# Altium schematic sheet MotorDriver.SchDoc
size A4
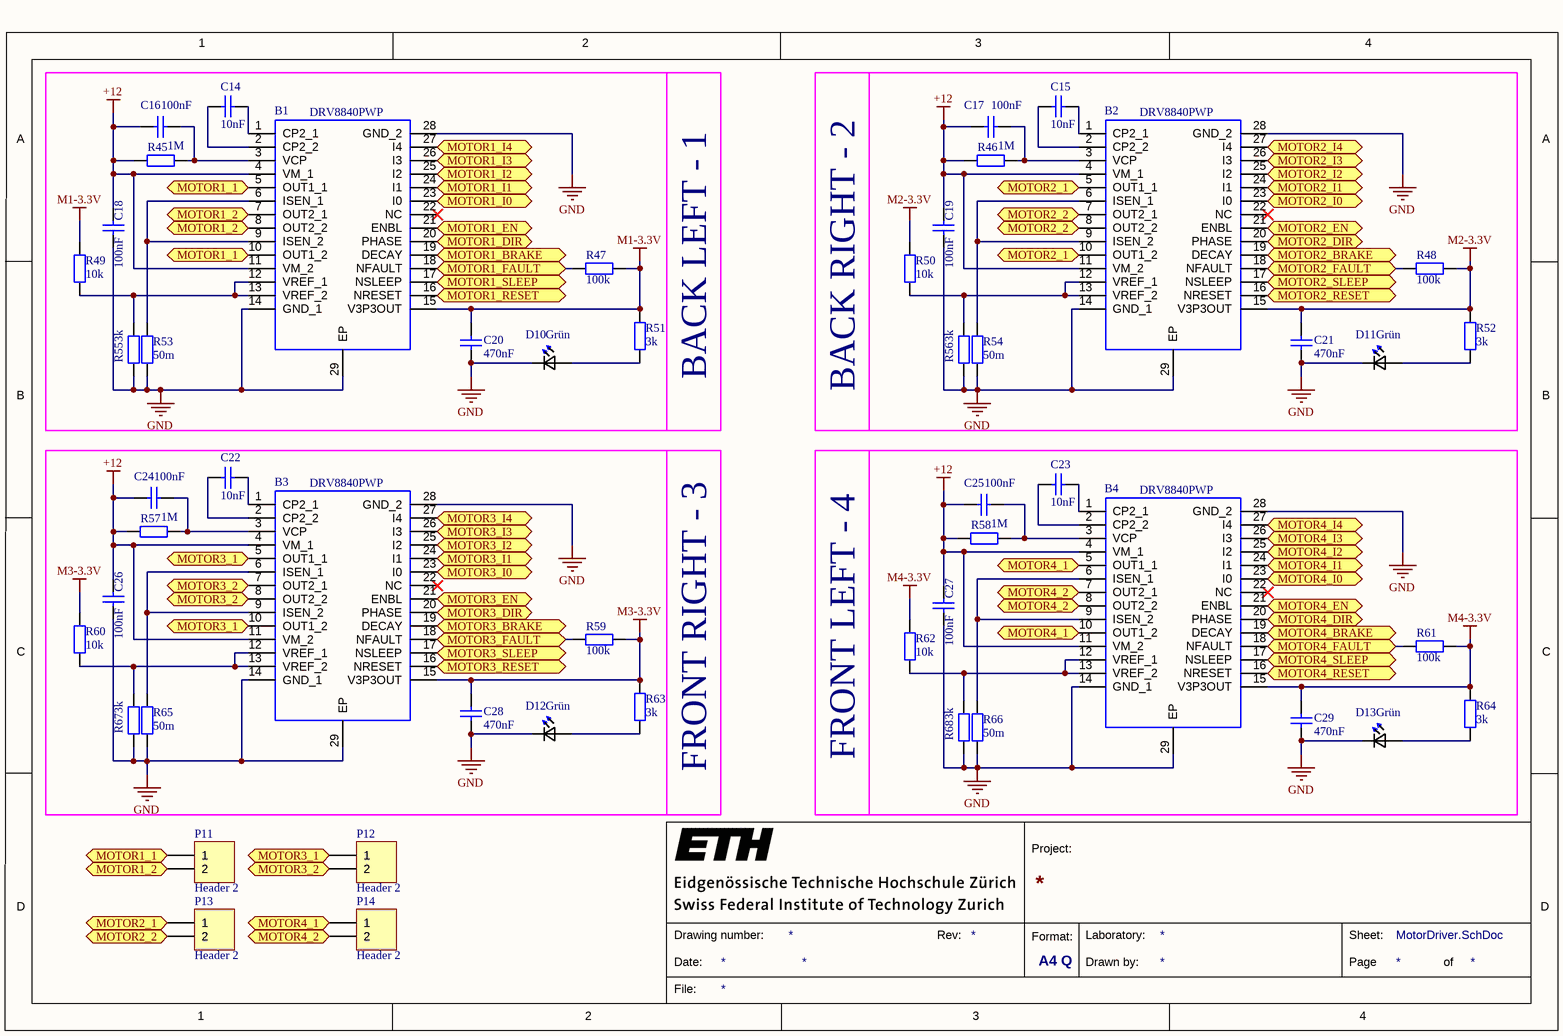
[diagram p0: MotorDriver.SchDoc]

## Parts
B1  DRV8840PWP  [SOP65P640X120-29N]
B2  DRV8840PWP  [SOP65P640X120-29N]
B3  DRV8840PWP  [SOP65P640X120-29N]
B4  DRV8840PWP  [SOP65P640X120-29N]
C14  10nF  [CAP_0603i_1608m -N]
C15  10nF  [CAP_0603i_1608m -N]
C16  100nF  [CAP_0603i_1608m -N]
C17  100nF  [CAP_0603i_1608m -N]
C18  100nF  [CAP_0603i_1608m -N]
C19  100nF  [CAP_0603i_1608m -N]
C20  470nF  [CAP_0603i_1608m -N]
C21  470nF  [CAP_0603i_1608m -N]
C22  10nF  [CAP_0603i_1608m -N]
C23  10nF  [CAP_0603i_1608m -N]
C24  100nF  [CAP_0603i_1608m -N]
C25  100nF  [CAP_0603i_1608m -N]
C26  100nF  [CAP_0603i_1608m -N]
C27  100nF  [CAP_0603i_1608m -N]
C28  470nF  [CAP_0603i_1608m -N]
C29  470nF  [CAP_0603i_1608m -N]
D10  Grün  [*0603]
D11  Grün  [*0603]
D12  Grün  [*0603]
D13  Grün  [*0603]
P11  Header 2  [3.5MM Phoenix Contact 1984617]
P12  Header 2  [3.5MM Phoenix Contact 1984617]
P13  Header 2  [3.5MM Phoenix Contact 1984617]
P14  Header 2  [3.5MM Phoenix Contact 1984617]
R45  1M  [RES_0805i_2012m -N]
R46  1M  [RES_0805i_2012m -N]
R47  100k  [RES_0805i_2012m -N]
R48  100k  [RES_0805i_2012m -N]
R49  10k  [RES_0805i_2012m -N]
R50  10k  [RES_0805i_2012m -N]
R51  3k  [RES_0805i_2012m -N]
R52  3k  [RES_0805i_2012m -N]
R53  50m  [RES_1206i_C3216m -N]
R54  50m  [RES_1206i_C3216m -N]
R55  3k  [RES_0805i_2012m -N]
R56  3k  [RES_0805i_2012m -N]
R57  1M  [RES_0805i_2012m -N]
R58  1M  [RES_0805i_2012m -N]
R59  100k  [RES_0805i_2012m -N]
R60  10k  [RES_0805i_2012m -N]
R61  100k  [RES_0805i_2012m -N]
R62  10k  [RES_0805i_2012m -N]
R63  3k  [RES_0805i_2012m -N]
R64  3k  [RES_0805i_2012m -N]
R65  50m  [RES_1206i_C3216m -N]
R66  50m  [RES_1206i_C3216m -N]
R67  3k  [RES_0805i_2012m -N]
R68  3k  [RES_0805i_2012m -N]

## Ports
MOTOR1_1 (bidir), MOTOR1_2 (bidir), MOTOR1_BRAKE (bidir), MOTOR1_DIR (bidir), MOTOR1_EN (bidir), MOTOR1_FAULT (bidir), MOTOR1_I0 (bidir), MOTOR1_I1 (bidir), MOTOR1_I2 (bidir), MOTOR1_I3 (bidir), MOTOR1_I4 (bidir), MOTOR1_RESET (bidir), MOTOR1_SLEEP (bidir), MOTOR2_1 (bidir), MOTOR2_2 (bidir), MOTOR2_BRAKE (bidir), MOTOR2_DIR (bidir), MOTOR2_EN (bidir), MOTOR2_FAULT (bidir), MOTOR2_I0 (bidir), MOTOR2_I1 (bidir), MOTOR2_I2 (bidir), MOTOR2_I3 (bidir), MOTOR2_I4 (bidir), MOTOR2_RESET (bidir), MOTOR2_SLEEP (bidir), MOTOR3_1 (bidir), MOTOR3_2 (bidir), MOTOR3_BRAKE (bidir), MOTOR3_DIR (bidir), MOTOR3_EN (bidir), MOTOR3_FAULT (bidir), MOTOR3_I0 (bidir), MOTOR3_I1 (bidir), MOTOR3_I2 (bidir), MOTOR3_I3 (bidir), MOTOR3_I4 (bidir), MOTOR3_RESET (bidir), MOTOR3_SLEEP (bidir), MOTOR4_1 (bidir), MOTOR4_2 (bidir), MOTOR4_BRAKE (bidir), MOTOR4_DIR (bidir), MOTOR4_EN (bidir), MOTOR4_FAULT (bidir), MOTOR4_I0 (bidir), MOTOR4_I1 (bidir), MOTOR4_I2 (bidir), MOTOR4_I3 (bidir), MOTOR4_I4 (bidir), MOTOR4_RESET (bidir), MOTOR4_SLEEP (bidir)

## Nets
+12: B1.4(VM_1) B1.11(VM_2) B2.4(VM_1) B2.11(VM_2) B3.4(VM_1) B3.11(VM_2) B4.4(VM_1) B4.11(VM_2) C16.1 C17.2 C18.1 C19.1 C24.2 C25.2 C26.1 C27.1 R45.1 R46.1 R57.1 R58.1
GND: B1.14(GND_1) B1.28(GND_2) B1.29(EP) B2.14(GND_1) B2.28(GND_2) B2.29(EP) B3.14(GND_1) B3.28(GND_2) B3.29(EP) B4.14(GND_1) B4.28(GND_2) B4.29(EP) C18.2 C19.2 C20.1 C21.1 C26.2 C27.2 C28.1 C29.1 D10.1(K2) D11.1(K2) D12.1(K2) D13.1(K2) R53.1 R54.1 R55.1 R56.1 R65.1 R66.1 R67.1 R68.1
M1-3.3V: B1.15(V3P3OUT) C20.2 R47.2 R49.2 R51.2
M2-3.3V: B2.15(V3P3OUT) C21.2 R48.2 R50.2 R52.2
M3-3.3V: B3.15(V3P3OUT) C28.2 R59.2 R60.2 R63.2
M4-3.3V: B4.15(V3P3OUT) C29.2 R61.2 R62.2 R64.2
MOTOR1_1: B1.5(OUT1_1) B1.10(OUT1_2) P11.1 ; port MOTOR1_1
MOTOR1_2: B1.7(OUT2_1) B1.8(OUT2_2) P11.2 ; port MOTOR1_2
MOTOR1_BRAKE: B1.19(DECAY) ; port MOTOR1_BRAKE
MOTOR1_DIR: B1.20(PHASE) ; port MOTOR1_DIR
MOTOR1_EN: B1.21(ENBL) ; port MOTOR1_EN
MOTOR1_FAULT: B1.18(NFAULT) R47.1 ; port MOTOR1_FAULT
MOTOR1_I0: B1.23(I0) ; port MOTOR1_I0
MOTOR1_I1: B1.24(I1) ; port MOTOR1_I1
MOTOR1_I2: B1.25(I2) ; port MOTOR1_I2
MOTOR1_I3: B1.26(I3) ; port MOTOR1_I3
MOTOR1_I4: B1.27(I4) ; port MOTOR1_I4
MOTOR1_RESET: B1.16(NRESET) ; port MOTOR1_RESET
MOTOR1_SLEEP: B1.17(NSLEEP) ; port MOTOR1_SLEEP
MOTOR2_1: B2.5(OUT1_1) B2.10(OUT1_2) P13.1 ; port MOTOR2_1
MOTOR2_2: B2.7(OUT2_1) B2.8(OUT2_2) P13.2 ; port MOTOR2_2
MOTOR2_BRAKE: B2.19(DECAY) ; port MOTOR2_BRAKE
MOTOR2_DIR: B2.20(PHASE) ; port MOTOR2_DIR
MOTOR2_EN: B2.21(ENBL) ; port MOTOR2_EN
MOTOR2_FAULT: B2.18(NFAULT) R48.1 ; port MOTOR2_FAULT
MOTOR2_I0: B2.23(I0) ; port MOTOR2_I0
MOTOR2_I1: B2.24(I1) ; port MOTOR2_I1
MOTOR2_I2: B2.25(I2) ; port MOTOR2_I2
MOTOR2_I3: B2.26(I3) ; port MOTOR2_I3
MOTOR2_I4: B2.27(I4) ; port MOTOR2_I4
MOTOR2_RESET: B2.16(NRESET) ; port MOTOR2_RESET
MOTOR2_SLEEP: B2.17(NSLEEP) ; port MOTOR2_SLEEP
MOTOR3_1: B3.5(OUT1_1) B3.10(OUT1_2) P12.1 ; port MOTOR3_1
MOTOR3_2: B3.7(OUT2_1) B3.8(OUT2_2) P12.2 ; port MOTOR3_2
MOTOR3_BRAKE: B3.19(DECAY) ; port MOTOR3_BRAKE
MOTOR3_DIR: B3.20(PHASE) ; port MOTOR3_DIR
MOTOR3_EN: B3.21(ENBL) ; port MOTOR3_EN
MOTOR3_FAULT: B3.18(NFAULT) R59.1 ; port MOTOR3_FAULT
MOTOR3_I0: B3.23(I0) ; port MOTOR3_I0
MOTOR3_I1: B3.24(I1) ; port MOTOR3_I1
MOTOR3_I2: B3.25(I2) ; port MOTOR3_I2
MOTOR3_I3: B3.26(I3) ; port MOTOR3_I3
MOTOR3_I4: B3.27(I4) ; port MOTOR3_I4
MOTOR3_RESET: B3.16(NRESET) ; port MOTOR3_RESET
MOTOR3_SLEEP: B3.17(NSLEEP) ; port MOTOR3_SLEEP
MOTOR4_1: B4.5(OUT1_1) B4.10(OUT1_2) P14.1 ; port MOTOR4_1
MOTOR4_2: B4.7(OUT2_1) B4.8(OUT2_2) P14.2 ; port MOTOR4_2
MOTOR4_BRAKE: B4.19(DECAY) ; port MOTOR4_BRAKE
MOTOR4_DIR: B4.20(PHASE) ; port MOTOR4_DIR
MOTOR4_EN: B4.21(ENBL) ; port MOTOR4_EN
MOTOR4_FAULT: B4.18(NFAULT) R61.1 ; port MOTOR4_FAULT
MOTOR4_I0: B4.23(I0) ; port MOTOR4_I0
MOTOR4_I1: B4.24(I1) ; port MOTOR4_I1
MOTOR4_I2: B4.25(I2) ; port MOTOR4_I2
MOTOR4_I3: B4.26(I3) ; port MOTOR4_I3
MOTOR4_I4: B4.27(I4) ; port MOTOR4_I4
MOTOR4_RESET: B4.16(NRESET) ; port MOTOR4_RESET
MOTOR4_SLEEP: B4.17(NSLEEP) ; port MOTOR4_SLEEP
NetB1_1: B1.1(CP2_1) C14.1
NetB1_2: B1.2(CP2_2) C14.2
NetB1_3: B1.3(VCP) C16.2 R45.2
NetB1_6: B1.6(ISEN_1) B1.9(ISEN_2) R53.2
NetB1_12: B1.12(VREF_1) B1.13(VREF_2) R49.1 R55.2
NetB2_1: B2.1(CP2_1) C15.1
NetB2_2: B2.2(CP2_2) C15.2
NetB2_3: B2.3(VCP) C17.1 R46.2
NetB2_6: B2.6(ISEN_1) B2.9(ISEN_2) R54.2
NetB2_12: B2.12(VREF_1) B2.13(VREF_2) R50.1 R56.2
NetB3_1: B3.1(CP2_1) C22.1
NetB3_2: B3.2(CP2_2) C22.2
NetB3_3: B3.3(VCP) C24.1 R57.2
NetB3_6: B3.6(ISEN_1) B3.9(ISEN_2) R65.2
NetB3_12: B3.12(VREF_1) B3.13(VREF_2) R60.1 R67.2
NetB4_1: B4.1(CP2_1) C23.1
NetB4_2: B4.2(CP2_2) C23.2
NetB4_3: B4.3(VCP) C25.1 R58.2
NetB4_6: B4.6(ISEN_1) B4.9(ISEN_2) R66.2
NetB4_12: B4.12(VREF_1) B4.13(VREF_2) R62.1 R68.2
NetD10_2: D10.2(A2) R51.1
NetD11_2: D11.2(A2) R52.1
NetD12_2: D12.2(A2) R63.1
NetD13_2: D13.2(A2) R64.1

Not connected (* = marked no-connect by the designer): B1 22(NC)*; B2 22(NC)*; B3 22(NC)*; B4 22(NC)*

## Notes on the sheet
- (near R51) BACK LEFT - 1
- (near R50) BACK RIGHT - 2
- (near R63) FRONT RIGHT - 3
- (near R62) FRONT LEFT - 4
- 1
- 2
- 3
- 4
- A
- B
- C
- Project:
- D
- Date:
- Drawing number:
- Rev:
- Format:
- A4 Q
- Drawn by:
- Laboratory:
- Page
- Sheet:
- of
- File:

## Library data of the parts
B1-B4 = DRV8840PWP: Texas Instruments DRV8840PWP, Full Bridge Motor Driver, DC Motor Driver, 28-Pin HTSSOP; Geometry.Height: 1.2mm; Mouser Part Number: 595-DRV8840PWP; Mouser Price/Stock: https://www.mouser.com/Search/Refine.aspx?Keyword=595-DRV8840PWP; Manufacturer_Name: Texas Instruments; Manufacturer_Part_Number: DRV8840PWP; Datasheet Link: http://www.ti.com/lit/ds/symlink/drv8840.pdf
C14 C15 C22 C23 = Cap: 50V
C16-C21 C24-C29 = Cap: capacitor
D10-D13 = LTST-C191KGKT: / LED; SMD; 0603; grün; 35mcd; 1.6x0.8x0.55mm; 130Â°; 2Ã·2.V; 20mA /; MF: Lite-On Inc.; Digi-Key_Purchase_URL: https://www.digikey.ch/product-detail/de/lite-on-inc/LTST-C191KGKT/160-1446-1-ND/386834; SnapEDA_Link: https://www.snapeda.com/parts/LTST-C191KFKT/Lite-On%20Inc./view-part/?ref=snap; MP: LTST-C191KGKT; Digi-Key_Part_Number: 160-1446-1-ND; Package: 0603 Lite-On; Value: *
P11-P14 = Header 2: Header, 2-Pin
R45-R68 = Res: Resistor